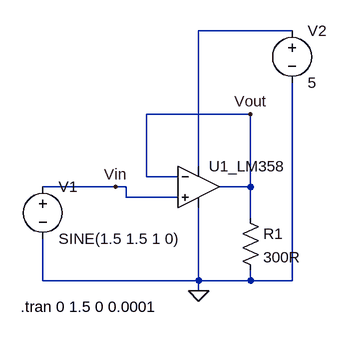
[diagram p0: schematic Voltage-to-current.asc]
Voltage-to-current.asc, the LTspice schematic file:
Version 4
SHEET 1 880 680
WIRE 384 -112 240 -112
WIRE 320 16 160 16
WIRE 240 96 240 -112
WIRE 160 112 160 16
WIRE 208 112 160 112
WIRE 112 128 0 128
WIRE 128 128 112 128
WIRE 320 128 320 16
WIRE 320 128 272 128
WIRE 128 144 128 128
WIRE 208 144 128 144
WIRE 320 176 320 128
WIRE 0 272 0 208
WIRE 240 272 240 160
WIRE 240 272 0 272
WIRE 320 272 320 256
WIRE 320 272 240 272
WIRE 384 272 384 -32
WIRE 384 272 320 272
WIRE 240 288 240 272
FLAG 240 288 0
FLAG 112 128 Vin
FLAG 320 16 Vout
SYMBOL OpAmps\\UniversalOpAmp 240 128 R0
SYMATTR InstName U1_LM358
SYMATTR Value2 Avol=1Meg GBW=0.7Meg Vos=0.007
SYMBOL voltage 0 112 R0
WINDOW 123 0 0 Left 0
WINDOW 39 0 0 Left 0
SYMATTR InstName V1
SYMATTR Value SINE(1.5 1.5 1 0)
SYMBOL voltage 384 -128 R0
WINDOW 123 0 0 Left 0
WINDOW 39 0 0 Left 0
SYMATTR InstName V2
SYMATTR Value 5
SYMBOL res 304 160 R0
SYMATTR InstName R1
SYMATTR Value 300R
TEXT -34 312 Left 2 !.tran 0 1.5 0 0.0001

The netlist it stands for:
* Voltage-to-current.asc
XU1_LM358 Vin Vout N001 0 Vout level1 Avol=1Meg GBW=0.7Meg Vos=0.007 En=0 Enk=0 In=0 Ink=0 Rin=500Meg  ; pins In+ In- V+ V- OUT
V1 Vin 0 SINE(1.5 1.5 1 0)
V2 N001 0 5
R1 Vout 0 300R
.tran 0 1.5 0 0.0001
.lib UniversalOpAmp1.lib
.backanno
.end